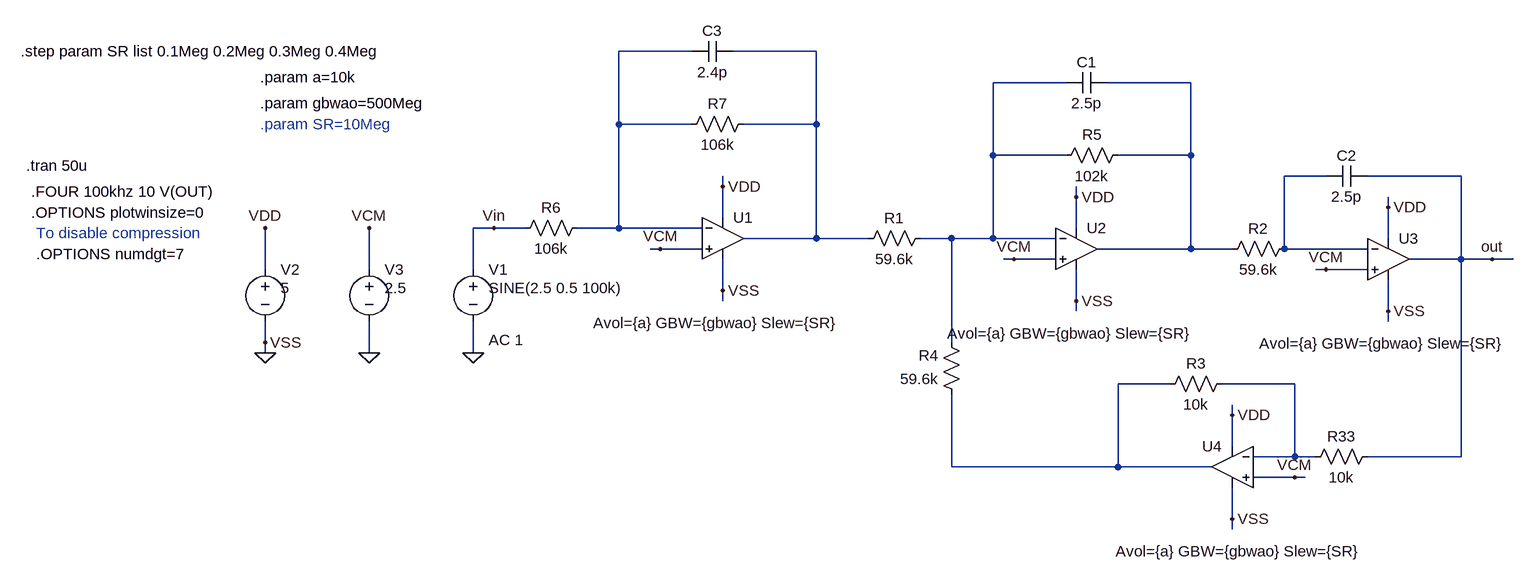
[diagram p0: schematic FTJ_ord3_AO_Model_efect_SR.asc]
FTJ_ord3_AO_Model_efect_SR.asc, the LTspice schematic file:
Version 4
SHEET 1 2700 1708
WIRE 368 -160 256 -160
WIRE 560 -160 432 -160
WIRE 944 -112 832 -112
WIRE 1136 -112 1008 -112
WIRE 256 -48 256 -160
WIRE 368 -48 256 -48
WIRE 560 -48 560 -160
WIRE 560 -48 448 -48
WIRE 832 0 832 -112
WIRE 944 0 832 0
WIRE 1136 0 1136 -112
WIRE 1136 0 1024 0
WIRE 1344 32 1280 32
WIRE 1552 32 1408 32
WIRE 416 48 416 32
WIRE 960 64 960 48
WIRE 1440 80 1440 64
WIRE 416 96 416 48
WIRE 64 112 32 112
WIRE 112 112 64 112
WIRE 256 112 256 -48
WIRE 256 112 192 112
WIRE 384 112 256 112
WIRE 960 112 960 64
WIRE 560 128 560 -48
WIRE 560 128 448 128
WIRE 640 128 560 128
WIRE 768 128 720 128
WIRE 832 128 832 0
WIRE 832 128 768 128
WIRE 928 128 832 128
WIRE 1440 128 1440 80
WIRE 320 144 304 144
WIRE 384 144 320 144
WIRE 1136 144 1136 0
WIRE 1136 144 992 144
WIRE 1200 144 1136 144
WIRE 1280 144 1280 32
WIRE 1408 144 1280 144
WIRE 864 160 848 160
WIRE 928 160 864 160
WIRE 1552 160 1552 32
WIRE 1552 160 1472 160
WIRE 1600 160 1552 160
WIRE 1632 160 1600 160
WIRE -288 176 -288 112
WIRE -128 176 -128 112
WIRE 32 176 32 112
WIRE 1344 176 1328 176
WIRE 1408 176 1344 176
WIRE 416 208 416 160
WIRE 416 224 416 208
WIRE 960 224 960 176
WIRE 960 240 960 224
WIRE 1440 240 1440 192
WIRE 1440 256 1440 240
WIRE -288 288 -288 256
WIRE 768 288 768 128
WIRE -288 304 -288 288
WIRE -128 304 -128 256
WIRE 32 304 32 256
WIRE 1104 352 1024 352
WIRE 1296 352 1184 352
WIRE 1200 400 1200 384
WIRE 1200 448 1200 400
WIRE 1296 464 1296 352
WIRE 1296 464 1232 464
WIRE 1328 464 1296 464
WIRE 1552 464 1552 160
WIRE 1552 464 1408 464
WIRE 768 480 768 368
WIRE 1024 480 1024 352
WIRE 1024 480 768 480
WIRE 1168 480 1024 480
WIRE 1296 496 1232 496
WIRE 1312 496 1296 496
WIRE 1200 560 1200 512
WIRE 1200 576 1200 560
FLAG 32 304 0
FLAG 1600 160 out
FLAG -288 304 0
FLAG -128 304 0
FLAG -288 112 VDD
FLAG -128 112 VCM
FLAG -288 288 VSS
FLAG 416 208 VSS
FLAG 416 48 VDD
FLAG 320 144 VCM
FLAG 960 224 VSS
FLAG 960 64 VDD
FLAG 864 160 VCM
FLAG 1440 240 VSS
FLAG 1440 80 VDD
FLAG 1344 176 VCM
FLAG 1200 560 VSS
FLAG 1200 400 VDD
FLAG 1296 496 VCM
FLAG 64 112 Vin
SYMBOL cap 1408 16 R90
WINDOW 0 0 32 VBottom 2
WINDOW 3 32 32 VTop 2
SYMATTR InstName C2
SYMATTR Value 2.5p
SYMBOL res 1200 336 R90
WINDOW 0 0 56 VBottom 2
WINDOW 3 32 56 VTop 2
SYMATTR InstName R3
SYMATTR Value 10k
SYMBOL res 1424 448 R90
WINDOW 0 0 56 VBottom 2
WINDOW 3 32 56 VTop 2
SYMATTR InstName R33
SYMATTR Value 10k
SYMBOL cap 1008 -128 R90
WINDOW 0 0 32 VBottom 2
WINDOW 3 32 32 VTop 2
SYMATTR InstName C1
SYMATTR Value 2.5p
SYMBOL voltage 32 160 R0
WINDOW 123 24 124 Left 2
WINDOW 39 0 0 Left 2
WINDOW 3 24 44 Left 2
SYMATTR Value2 AC 1
SYMATTR Value SINE(2.5 0.5 100k)
SYMATTR InstName V1
SYMBOL voltage -288 160 R0
WINDOW 123 24 124 Left 2
WINDOW 39 0 0 Left 2
WINDOW 3 24 44 Left 2
SYMATTR Value 5
SYMATTR InstName V2
SYMBOL voltage -128 160 R0
WINDOW 123 24 124 Left 2
WINDOW 39 0 0 Left 2
WINDOW 3 24 44 Left 2
SYMATTR Value 2.5
SYMATTR InstName V3
SYMBOL res 736 112 R90
WINDOW 0 0 56 VBottom 2
WINDOW 3 32 56 VTop 2
SYMATTR InstName R1
SYMATTR Value 59.6k
SYMBOL res 1296 128 R90
WINDOW 0 0 56 VBottom 2
WINDOW 3 32 56 VTop 2
SYMATTR InstName R2
SYMATTR Value 59.6k
SYMBOL res 784 384 R180
WINDOW 0 36 76 Left 2
WINDOW 3 36 40 Left 2
SYMATTR InstName R4
SYMATTR Value 59.6k
SYMBOL res 1040 -16 R90
WINDOW 0 0 56 VBottom 2
WINDOW 3 32 56 VTop 2
SYMATTR InstName R5
SYMATTR Value 102k
SYMBOL res 208 96 R90
WINDOW 0 0 56 VBottom 2
WINDOW 3 32 56 VTop 2
SYMATTR InstName R6
SYMATTR Value 106k
SYMBOL cap 432 -176 R90
WINDOW 0 0 32 VBottom 2
WINDOW 3 32 32 VTop 2
SYMATTR InstName C3
SYMATTR Value 2.4p
SYMBOL res 464 -64 R90
WINDOW 0 0 56 VBottom 2
WINDOW 3 32 56 VTop 2
SYMATTR InstName R7
SYMATTR Value 106k
SYMBOL Opamps\\UniversalOpamp2 416 128 R0
WINDOW 123 -199 130 Left 2
SYMATTR Value2 Avol={a} GBW={gbwao} Slew={SR}
SYMATTR InstName U1
SYMBOL Opamps\\UniversalOpamp2 960 144 R0
WINDOW 123 -199 130 Left 2
SYMATTR Value2 Avol={a} GBW={gbwao} Slew={SR}
SYMATTR InstName U2
SYMBOL Opamps\\UniversalOpamp2 1440 160 R0
WINDOW 123 -199 130 Left 2
SYMATTR Value2 Avol={a} GBW={gbwao} Slew={SR}
SYMATTR InstName U3
SYMBOL Opamps\\UniversalOpamp2 1200 480 M0
WINDOW 123 -199 130 Left 2
SYMATTR Value2 Avol={a} GBW={gbwao} Slew={SR}
SYMATTR InstName U4
TEXT -656 16 Left 2 !.tran 50u
TEXT -296 -120 Left 2 !.param a=10k
TEXT -296 -80 Left 2 !.param gbwao=500Meg
TEXT -296 -48 Left 2 ;.param SR=10Meg
TEXT -648 56 Left 2 !.FOUR 100khz 10 V(OUT)
TEXT -648 88 Left 2 !.OPTIONS plotwinsize=0
TEXT -640 120 Left 2 ;To disable compression
TEXT -640 152 Left 2 !.OPTIONS numdgt=7
TEXT -664 -160 Left 2 !.step param SR list 0.1Meg 0.2Meg 0.3Meg 0.4Meg

The netlist it stands for:
* FTJ_ord3_AO_Model_efect_SR.asc
C2 out N005 2.5p
R3 N007 N006 10k
R33 out N007 10k
C1 N004 N003 2.5p
V1 Vin 0 SINE(2.5 0.5 100k) AC 1
V2 VDD 0 5
V3 VCM 0 2.5
R1 N003 N002 59.6k
R2 N005 N004 59.6k
R4 N006 N003 59.6k
R5 N004 N003 102k
R6 N001 Vin 106k
C3 N002 N001 2.4p
R7 N002 N001 106k
XU1 VCM N001 VDD 0 N002 level.2 Avol={a} GBW={gbwao} Slew={SR} ilimit=25m rail=0 Vos=0 phimargin=45 en=0 enk=0 in=0 ink=0 Rin=500Meg  ; pins IN+ IN- V+ V- OUT
XU2 VCM N003 VDD 0 N004 level.2 Avol={a} GBW={gbwao} Slew={SR} ilimit=25m rail=0 Vos=0 phimargin=45 en=0 enk=0 in=0 ink=0 Rin=500Meg  ; pins IN+ IN- V+ V- OUT
XU3 VCM N005 VDD 0 out level.2 Avol={a} GBW={gbwao} Slew={SR} ilimit=25m rail=0 Vos=0 phimargin=45 en=0 enk=0 in=0 ink=0 Rin=500Meg  ; pins IN+ IN- V+ V- OUT
XU4 VCM N007 VDD 0 N006 level.2 Avol={a} GBW={gbwao} Slew={SR} ilimit=25m rail=0 Vos=0 phimargin=45 en=0 enk=0 in=0 ink=0 Rin=500Meg  ; pins IN+ IN- V+ V- OUT
.tran 50u
.param a=10k
.param gbwao=500Meg
* .param SR=10Meg
.FOUR 100khz 10 V(OUT)
.OPTIONS plotwinsize=0
* To disable compression
.OPTIONS numdgt=7
.step param SR list 0.1Meg 0.2Meg 0.3Meg 0.4Meg
.lib UniversalOpamps2.sub
.backanno
.end